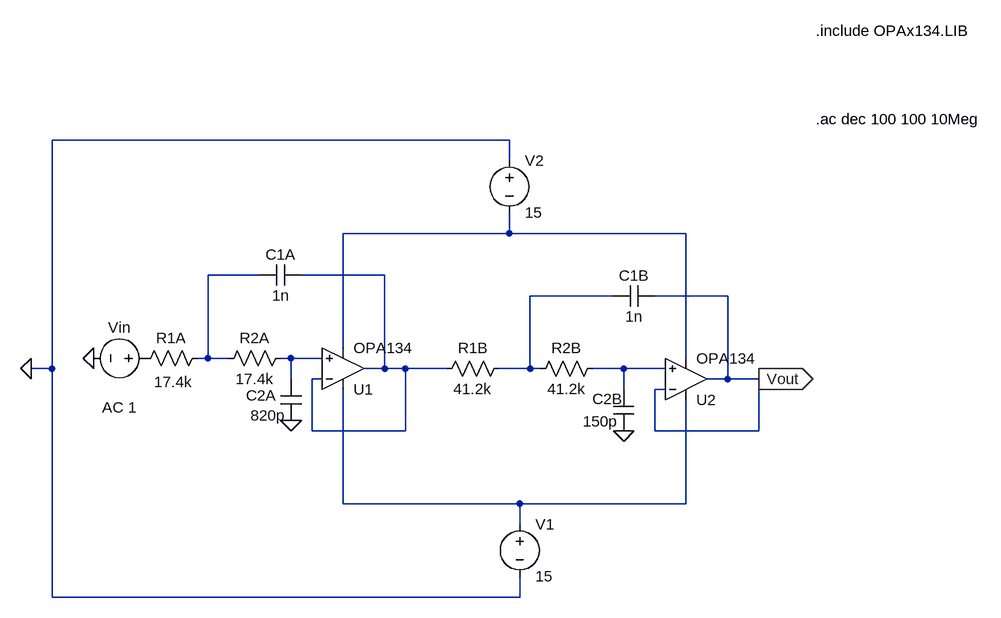
[diagram p0: schematic Sallen key.asc]
Sallen key.asc, the LTspice schematic file:
Version 4
SHEET 1 2220 680
WIRE 320 -240 -384 -240
WIRE 320 -208 320 -240
WIRE 320 -96 320 -128
WIRE 320 -96 64 -96
WIRE 592 -96 320 -96
WIRE -64 -32 -144 -32
WIRE 128 -32 0 -32
WIRE 480 0 352 0
WIRE 656 0 544 0
WIRE 64 80 64 -96
WIRE -144 96 -144 -32
WIRE -144 96 -160 96
WIRE -112 96 -144 96
WIRE -16 96 -32 96
WIRE 32 96 -16 96
WIRE 592 96 592 -96
WIRE -384 112 -384 -240
WIRE -384 112 -416 112
WIRE 128 112 128 -32
WIRE 128 112 96 112
WIRE 160 112 128 112
WIRE 224 112 160 112
WIRE 352 112 352 0
WIRE 352 112 304 112
WIRE 368 112 352 112
WIRE 496 112 448 112
WIRE 560 112 496 112
WIRE -16 128 -16 96
WIRE 32 128 16 128
WIRE 656 128 656 0
WIRE 656 128 624 128
WIRE 704 128 656 128
WIRE 496 144 496 112
WIRE 560 144 544 144
WIRE 16 208 16 128
WIRE 160 208 160 112
WIRE 160 208 16 208
WIRE 544 208 544 144
WIRE 704 208 704 128
WIRE 704 208 544 208
WIRE 64 320 64 144
WIRE 336 320 64 320
WIRE 592 320 592 160
WIRE 592 320 336 320
WIRE 336 352 336 320
WIRE -384 464 -384 112
WIRE 336 464 336 432
WIRE 336 464 -384 464
FLAG -16 192 0
FLAG 496 208 0
FLAG 704 128 Vout
IOPIN 704 128 Out
FLAG -416 112 0
FLAG -320 96 0
SYMBOL OpAmps\\opamp2 64 176 M180
SYMATTR InstName U1
SYMATTR Value OPA134
SYMBOL OpAmps\\opamp2 592 192 M180
SYMATTR InstName U2
SYMATTR Value OPA134
SYMBOL res -144 80 R90
WINDOW 0 0 56 VBottom 2
WINDOW 3 37 53 VTop 2
SYMATTR InstName R1A
SYMATTR Value 17.4k
SYMBOL res -128 112 R270
WINDOW 0 32 56 VTop 2
WINDOW 3 0 56 VBottom 2
SYMATTR InstName R2A
SYMATTR Value 17.4k
SYMBOL cap 0 -48 R90
WINDOW 0 0 32 VBottom 2
WINDOW 3 32 32 VTop 2
SYMATTR InstName C1A
SYMATTR Value 1n
SYMBOL cap 0 192 R180
WINDOW 0 39 39 Left 2
WINDOW 3 24 8 Left 2
SYMATTR InstName C2A
SYMATTR Value 820p
SYMBOL cap 480 144 R0
WINDOW 0 -32 15 Left 2
WINDOW 3 -47 49 Left 2
SYMATTR InstName C2B
SYMATTR Value 150p
SYMBOL res 320 96 R90
WINDOW 0 0 56 VBottom 2
WINDOW 3 32 56 VTop 2
SYMATTR InstName R1B
SYMATTR Value 41.2k
SYMBOL res 464 96 R90
WINDOW 0 0 56 VBottom 2
WINDOW 3 32 56 VTop 2
SYMATTR InstName R2B
SYMATTR Value 41.2k
SYMBOL cap 544 -16 R90
WINDOW 0 0 32 VBottom 2
WINDOW 3 32 32 VTop 2
SYMATTR InstName C1B
SYMATTR Value 1n
SYMBOL voltage 336 336 R0
WINDOW 123 0 0 Left 0
WINDOW 39 0 0 Left 0
SYMATTR InstName V1
SYMATTR Value 15
SYMBOL voltage 320 -224 R0
WINDOW 123 0 0 Left 0
WINDOW 39 0 0 Left 0
SYMATTR InstName V2
SYMATTR Value 15
SYMBOL voltage -224 96 R90
WINDOW 0 -32 56 VBottom 2
WINDOW 3 32 56 VTop 2
WINDOW 123 60 56 VTop 2
WINDOW 39 0 0 Left 0
SYMATTR InstName Vin
SYMATTR Value ""
SYMATTR Value2 AC 1
TEXT 792 -272 Left 2 !.ac dec 100 100 10Meg
TEXT 792 -408 Left 2 !.include OPAx134.LIB

The netlist it stands for:
* Sallen key.asc
XU1 N005 N003 N007 N001 N003 OPA134  ; pins In+ In- V+ V- OUT
XU2 N006 Vout N007 N001 Vout OPA134  ; pins In+ In- V+ V- OUT
R1A N002 P001 17.4k
R2A N002 N005 17.4k
C1A N003 N002 1n
C2A 0 N005 820p
C2B N006 0 150p
R1B N004 N003 41.2k
R2B N006 N004 41.2k
C1B Vout N004 1n
V1 N007 0 15
V2 0 N001 15
Vin P001 0 AC 1
.ac dec 100 100 10Meg
.include OPAx134.LIB
.backanno
.end